# Altium project Placa_FdC.PrjPCB
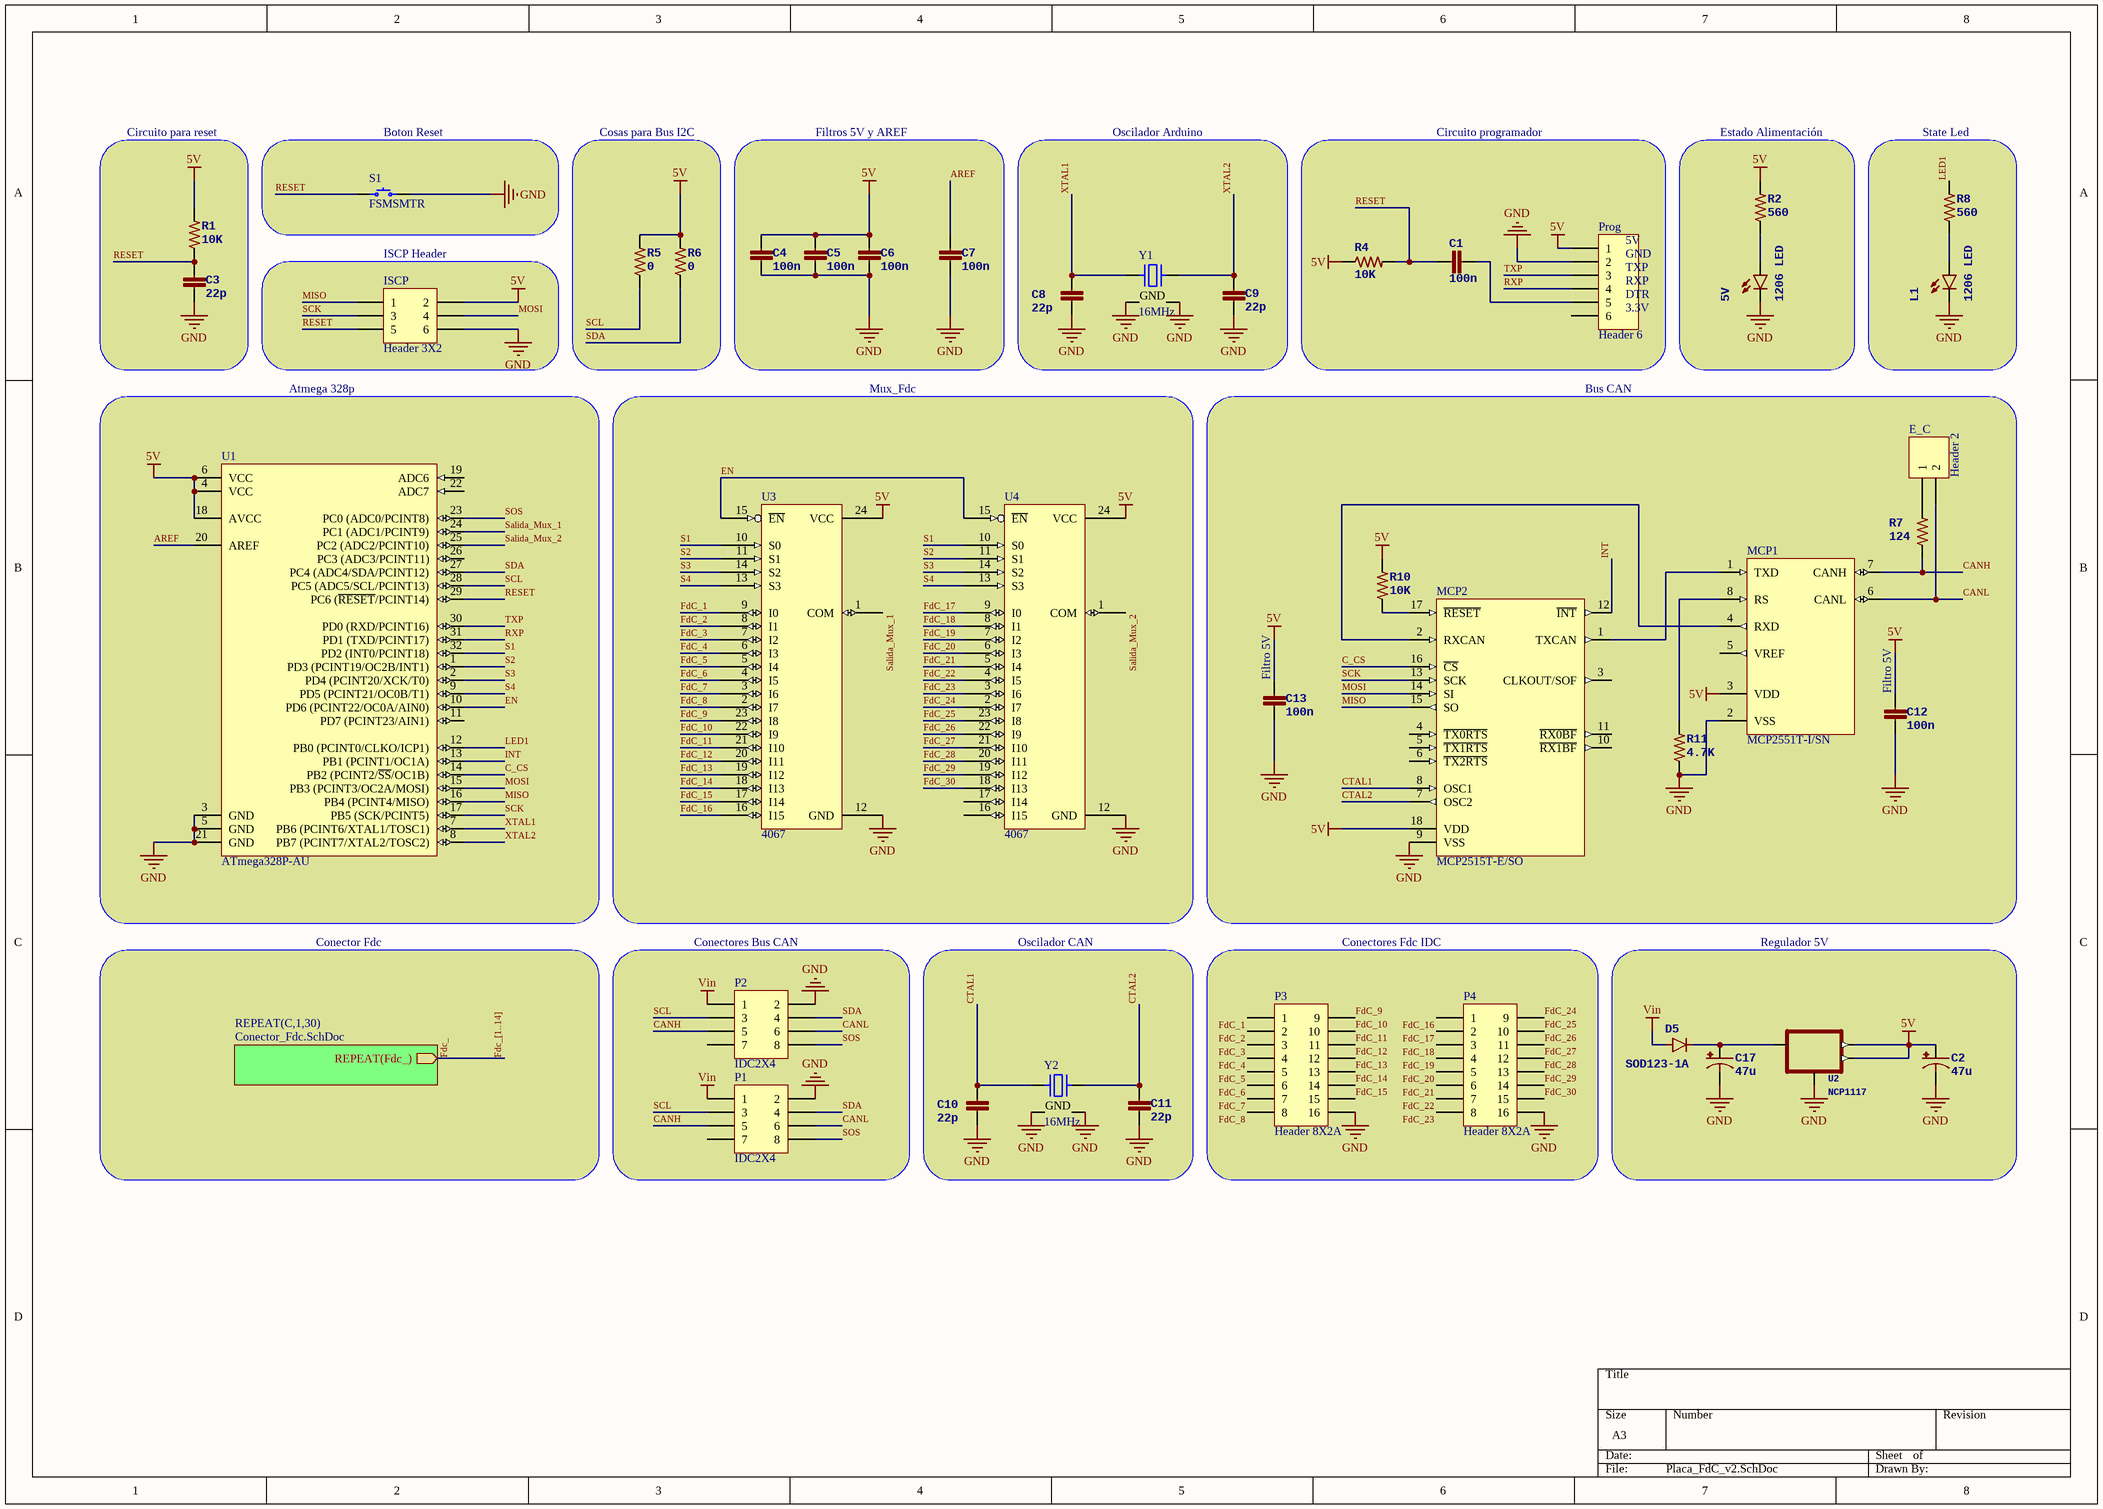
[diagram p0: Placa_FdC_v2.SchDoc]
2 sheets, 72 parts. Net scope: hierarchical (ports join the sheet entries above them; power ports are global).
Board file: Placa_FdC.PcbDoc
Sheets:
  Placa_FdC_v2.SchDoc
    C1 = Conector_Fdc.SchDoc
    C2 = Conector_Fdc.SchDoc
    C3 = Conector_Fdc.SchDoc
    C4 = Conector_Fdc.SchDoc
    C5 = Conector_Fdc.SchDoc
    C6 = Conector_Fdc.SchDoc
    C7 = Conector_Fdc.SchDoc
    C8 = Conector_Fdc.SchDoc
    C9 = Conector_Fdc.SchDoc
    C10 = Conector_Fdc.SchDoc
    C11 = Conector_Fdc.SchDoc
    C12 = Conector_Fdc.SchDoc
    C13 = Conector_Fdc.SchDoc
    C14 = Conector_Fdc.SchDoc
    C15 = Conector_Fdc.SchDoc
    C16 = Conector_Fdc.SchDoc
    C17 = Conector_Fdc.SchDoc
    C18 = Conector_Fdc.SchDoc
    C19 = Conector_Fdc.SchDoc
    C20 = Conector_Fdc.SchDoc
    C21 = Conector_Fdc.SchDoc
    C22 = Conector_Fdc.SchDoc
    C23 = Conector_Fdc.SchDoc
    C24 = Conector_Fdc.SchDoc
    C25 = Conector_Fdc.SchDoc
    C26 = Conector_Fdc.SchDoc
    C27 = Conector_Fdc.SchDoc
    C28 = Conector_Fdc.SchDoc
    C29 = Conector_Fdc.SchDoc
    C30 = Conector_Fdc.SchDoc

## Sheet Placa_FdC_v2.SchDoc
size A3

### Parts
5V  1206 LED  [LED-1206]
C1  100n  [0805]
C2  47u  [PANASONIC_D]
C3  22p  [0805]
C4  100n  [0805]
C5  100n  [0805]
C6  100n  [0805]
C7  100n  [0805]
C8  22p  [0805]
C9  22p  [0805]
C10  22p  [0805]
C11  22p  [0805]
C12  100n  [0805]
C13  100n  [0805]
C17  47u  [PANASONIC_D]
D5  SOD123-1A  [SOD-123]
E_C  Header 2  [HDR1X2]
ISCP  Header 3X2  [HDR2X3]
L1  1206 LED  [LED-1206]
MCP1  MCP2551T-I/SN  [SOIC-SN8_N]
MCP2  MCP2515T-E/SO  [SOIC-SO18_N]
P1  IDC2X4  [IDC2X4]
P2  IDC2X4  [IDC2X4]
P3  Header 8X2A  [HDR2X8_CEN]
P4  Header 8X2A  [HDR2X8_CEN]
Prog  Header 6  [HDR1X6]
R1  10K  [0805]
R2  560  [0805]
R4  10K  [0805]
R5  0  [0805]
R6  0  [0805]
R7  124  [0805]
R8  560  [0805]
R10  10K  [0805]
R11  4.7K  [0805]
S1  FSMSMTR  [TE FSMSMTR]
U1  ATmega328P-AU  [32A_N]
U2  NCP1117  [SOT223]
U3  4067  [SSOP-24]
U4  4067  [SSOP-24]
Y1  16MHz  [NDK NX3225SA]
Y2  16MHz  [NDK NX3225SA]

### Blocks framed on the sheet
Circuito para reset: C3 R1
Boton Reset: S1
Cosas para Bus I2C: R5 R6
Filtros 5V y AREF: C4-C7
Oscilador Arduino: C8 C9 Y1
Estado Alimentación: 5V R2
State Led: L1 R8
ISCP Header: ISCP
Atmega 328p: U1
Mux_Fdc: U3 U4
Conectores Bus CAN: P1 P2
Oscilador CAN: C10 C11 Y2
Conectores Fdc IDC: P3 P4
Regulador 5V: C2 C17 D5 U2

### Sub-sheets
REPEAT(C,1,30) = Conector_Fdc.SchDoc: REPEAT(Fdc_) (out)

### Nets
5V: C2.+ C4.1 C5.1 C6.1 C12.1 C13.1 ISCP.2 MCP1.3(VDD) MCP2.18(VDD) Prog.1 R1.2 R2.2 R4.1 R5.2 R6.2 R10.2 U1.4(VCC) U1.6(VCC) U1.18(AVCC) U2.2(OUT) U2.4(OUT@1) U3.24(VCC) U4.24(VCC)
GND: 5V.C C2.- C3.2 C4.2 C5.2 C6.2 C7.2 C8.2 C9.2 C10.2 C11.2 C12.2 C13.2 C17.- ISCP.6 L1.C MCP1.2(VSS) MCP2.9(VSS) P1.2 P2.2 P3.16 P4.16 Prog.2 R11.1 S1.2 U1.3(GND) U1.5(GND) U1.21(GND) U2.1(ADJ) U3.12(GND) U4.12(GND) Y1.2(GND) Y1.4(GND) Y2.2(GND) Y2.4(GND)
Vin: D5.A P1.1 P2.1
AREF: C7.1 U1.20(AREF)
C_CS: MCP2.16(~{CS}) U1.14(PB2_(PCINT2/~{SS}/OC1B))
CANH: MCP1.7(CANH) P1.5 P2.5 R7.1
CANL: E_C.2 MCP1.6(CANL) P1.6 P2.6
CTAL1: C10.1 MCP2.8(OSC1) Y2.1
CTAL2: C11.1 MCP2.7(OSC2) Y2.3
EN: U1.10(PD6_(PCINT22/OC0A/AIN0)) U3.15(~{EN}) U4.15(~{EN})
Fdc_: sheet REPEAT(C,1,30)/REPEAT(Fdc_)
FdC_1: P3.1 U3.9(I0)  [project net FdC]
FdC_2: P3.2 U3.8(I1)  [project net FdC]
FdC_3: P3.3 U3.7(I2)  [project net FdC]
FdC_4: P3.4 U3.6(I3)  [project net FdC]
FdC_5: P3.5 U3.5(I4)  [project net FdC]
FdC_6: P3.6 U3.4(I5)  [project net FdC]
FdC_7: P3.7 U3.3(I6)  [project net FdC]
FdC_8: P3.8 U3.2(I7)  [project net FdC]
FdC_9: P3.9 U3.23(I8)  [project net FdC]
FdC_10: P3.10 U3.22(I9)  [project net FdC]
FdC_11: P3.11 U3.21(I10)  [project net FdC]
FdC_12: P3.12 U3.20(I11)  [project net FdC]
FdC_13: P3.13 U3.19(I12)  [project net FdC]
FdC_14: P3.14 U3.18(I13)  [project net FdC]
FdC_15: P3.15 U3.17(I14)  [project net FdC]
FdC_16: P4.1 U3.16(I15)  [project net FdC]
FdC_17: P4.2 U4.9(I0)  [project net FdC]
FdC_18: P4.3 U4.8(I1)  [project net FdC]
FdC_19: P4.4 U4.7(I2)  [project net FdC]
FdC_20: P4.5 U4.6(I3)  [project net FdC]
FdC_21: P4.6 U4.5(I4)  [project net FdC]
FdC_22: P4.7 U4.4(I5)  [project net FdC]
FdC_23: P4.8 U4.3(I6)  [project net FdC]
FdC_24: P4.9 U4.2(I7)  [project net FdC]
FdC_25: P4.10 U4.23(I8)  [project net FdC]
FdC_26: P4.11 U4.22(I9)  [project net FdC]
FdC_27: P4.12 U4.21(I10)  [project net FdC]
FdC_28: P4.13 U4.20(I11)  [project net FdC]
FdC_29: P4.14 U4.19(I12)  [project net FdC]
FdC_30: P4.15 U4.18(I13)  [project net FdC]
INT: MCP2.12(~{INT}) U1.13(PB1_(PCINT1/OC1A))
LED1: R8.2 U1.12(PB0_(PCINT0/CLKO/ICP1))
MISO: ISCP.1 MCP2.15(SO) U1.16(PB4_(PCINT4/MISO))
MOSI: ISCP.4 MCP2.14(SI) U1.15(PB3_(PCINT3/OC2A/MOSI))
RESET: C1.1 C3.1 ISCP.5 R1.1 R4.2 S1.1 U1.29(PC6_(~{RESET}/PCINT14))
RXP: Prog.4 U1.31(PD1_(TXD/PCINT17))
S1: U1.32(PD2_(INT0/PCINT18)) U3.10(S0) U4.10(S0)
S2: U1.1(PD3_(PCINT19/OC2B/INT1)) U3.11(S1) U4.11(S1)
S3: U1.2(PD4_(PCINT20/XCK/T0)) U3.14(S2) U4.14(S2)
S4: U1.9(PD5_(PCINT21/OC0B/T1)) U3.13(S3) U4.13(S3)
Salida_Mux_1: U1.24(PC1_(ADC1/PCINT9)) U3.1(COM)
Salida_Mux_2: U1.25(PC2_(ADC2/PCINT10)) U4.1(COM)
SCK: ISCP.3 MCP2.13(SCK) U1.17(PB5_(SCK/PCINT5))
SCL: P1.3 P2.3 R5.1 U1.28(PC5_(ADC5/SCL/PCINT13))
SDA: P1.4 P2.4 R6.1 U1.27(PC4_(ADC4/SDA/PCINT12))
SOS: P1.8 P2.8 U1.23(PC0_(ADC0/PCINT8))
TXP: Prog.3 U1.30(PD0_(RXD/PCINT16))
XTAL1: C8.1 U1.7(PB6_(PCINT6/XTAL1/TOSC1)) Y1.1
XTAL2: C9.1 U1.8(PB7_(PCINT7/XTAL2/TOSC2)) Y1.3
Net5V_A: 5V.A R2.1
NetC1_2: C1.2 Prog.5
NetC17_+: C17.+ D5.C U2.3(IN)
NetE_C_1: E_C.1 R7.2
NetL1_A: L1.A R8.1
NetMCP1_1: MCP1.1(TXD) MCP2.1(TXCAN)
NetMCP1_4: MCP1.4(RXD) MCP2.2(RXCAN)
NetMCP1_8: MCP1.8(RS) R11.2
NetMCP2_17: MCP2.17(~{RESET}) R10.1

Not connected (* = marked no-connect by the designer): MCP1 5(VREF); MCP2 3(CLKOUT/SOF) 4(~{TX0RTS}) 5(~{TX1RTS}) 6(~{TX2RTS}) 10(~{RX1BF}) 11(~{RX0BF}); P1 7; P2 7; Prog 6; U1 11(PD7_(PCINT23/AIN1)) 19(ADC6) 22(ADC7) 26(PC3_(ADC3/PCINT11)); U4 16(I15) 17(I14)

### Buses and harness runs
bus Fdc_[1..14]

### Notes on the sheet
- Circuito programador
- (near Prog) 5V
- (near Prog) GND
- (near Prog) TXP
- (near Prog) RXP
- (near Prog) DTR
- (near Prog) 3.3V
- Bus CAN
- (near C13) Filtro 5V
- (near C12) Filtro 5V
- Conector Fdc

### Library data of the parts
5V L1 = LED1206
C1 C3-C13 = CAP0805
C2 C17 = 47UF-50V-20%(ELECT): PROD_ID: CAP-10547
D5 = DIODESOD123
E_C = Header 2: Header, 2-Pin; LatestRevisionDate: 17-Jul-2002; LatestRevisionNote: Re-released for DXP Platform.; Publisher: Altium Limited
ISCP = Header 3X2: Header, 3-Pin, Dual row; LatestRevisionDate: 17-Jul-2002; LatestRevisionNote: Re-released for DXP Platform.; Publisher: Altium Limited
MCP1 = MCP2551T-I/SN: High-Speed CAN Transceiver, 8-Pin SOIC, Industrial Temperature, Tape and Reel; Published: 29-Jan-2009; DatasheetVersion: revE, Jan-2007; PackageVersion: revBB, Aug-2009; PackageReference: SOIC-SN8; Publisher: Altium Limited; PackageDescription: 8-Lead Plastic Small Outline (SN) - Narrow, 3.90mm Body [SOIC]; Supplier 1: Digi-Key; Supplier Part Number 1: MCP2551T-I/SNTR-ND; Supplier 2: Farnell; Supplier Part Number 2: 1788569; Code_JEDEC: MS-012; Code_IPC: SOIC127P600-8; ComponentLink1Description: Datasheet; ComponentLink1URL: http://ww1.microchip.com/downloads/en/DeviceDoc/21667E.pdf; ComponentLink2Description: Packaging Specification; ComponentLink2URL: http://www.microchip.com/stellent/groups/techpub_sg/documents/packagingspec/en012702.pdf; ComponentLink3Description: Microchip.com Home; ComponentLink3URL: http://www.microchip.com/
MCP2 = MCP2515T-E/SO: Stand-Alone CAN Controller With SPI Interface, 18-Pin SOIC, Extended Temperature, Tape and Reel; Published: 29-Jan-2009; DatasheetVersion: revE, Nov-2007; PackageVersion: revBB, Aug-2009; PackageReference: SOIC-SO18; Publisher: Altium Limited; PackageDescription: 18-Lead Plastic Small Outline (SO) - Wide 7.50mm Body [SOIC]; Supplier 1: Digi-Key; Supplier Part Number 1: MCP2515T-E/SO-ND; Code_JEDEC: MS-013; ComponentLink1Description: Datasheet; ComponentLink1URL: http://ww1.microchip.com/downloads/en/DeviceDoc/21801e.pdf; ComponentLink2Description: Packaging Specification; ComponentLink2URL: http://www.microchip.com/stellent/groups/techpub_sg/documents/packagingspec/en012702.pdf; ComponentLink3Description: Microchip.com Home; ComponentLink3URL: http://www.microchip.com/
P1 P2 = IDC2X4: Header, 4-Pin, Dual row; LatestRevisionDate: 17-Jul-2002; LatestRevisionNote: Re-released for DXP Platform.; Publisher: Altium Limited
P3 P4 = Header 8X2A: Header, 8-Pin, Dual row; LatestRevisionDate: 17-Jul-2002; LatestRevisionNote: Re-released for DXP Platform.; Publisher: Altium Limited
Prog = Header 6: Header, 6-Pin; LatestRevisionDate: 17-Jul-2002; LatestRevisionNote: Re-released for DXP Platform.; Publisher: Altium Limited
R1 R2 R4-R8 R10 R11 = RESISTOR0805-RES
S1 = FSMSMTR: SWITCH TACTILE SPST-NO 0.05A 24V; Manufacturer: TE Connectivity Alcoswitch Switches; Switch Function: Off-Mom; Contact Rating @ Voltage: 0.05A @ 24VDC; Actuator Type: Standard; Actuator Orientation: Top Actuated; Illumination: Non-Illuminated; Operating Force: 180gf; Switch Travel: 0.25mm; Mechanical Life: 20,000 Cycles; Part Number: FSMSMTR; PartId: 8251; Supplier 1: Digi-Key; Supplier Part Number 1: 450-1758-2-ND; ComponentLink1Description: Datasheet; ComponentLink1URL: http://www.te.com/commerce/DocumentDelivery/DDEController?Action=srchrtrv&DocNm=1437566-3&DocType=Customer+Drawing&DocLang=English; ComponentLink2Description: Digi-Key Listing; ComponentLink2URL: http://www.digikey.com/product-detail/en/FSMSMTR/450-1758-2-ND/529671; Price: 0,175; Circuit: SPST-NO; Illumination Voltage: -; Illumination Type, Colour: -; Operating Temperature: -35C ~ 85C
U1 = ATmega328P-AU: 8-bit AVR Microcontroller, 32KB Flash, 1KB EEPROM, 2KB SRAM, 32-pin TQFP, Industrial Grade (-40°C to 85°C); Published: 1-Apr-2010; DatasheetVersion: revA, Jan-2010; PackageVersion: revB, Oct-2001; PackageReference: 32A; Publisher: Altium Limited; PackageDescription: 32-Lead, 7x7x1.0 mm Body, 0.8mm Lead Pitch, Thin Profile Plastic Quad Flat Package (TQFP); Supplier 1: Digi-Key; Supplier Part Number 1: ATMEGA328P-AU-ND; Supplier 2: Farnell; Supplier Part Number 2: 1715486; Supplier 3: Mouser; Supplier Part Number 3: 556-ATMEGA328P-AU; Code_JEDEC: MS-026-ABA; ComponentLink1Description: Manufacturer Link; ComponentLink1URL: http://www.atmel.com/products/avr/default.asp?; ComponentLink2Description: ATmega48A/48PA/88A/88PA/168A/168PA/328/328P Datasheet; ComponentLink2URL: http://www.atmel.com/dyn/resources/prod_documents/8271.pdf; ComponentLink3Description: ATmega48A/48PA/88A/88PA/168A/168PA/328/328P Summary; ComponentLink3URL: http://www.atmel.com/dyn/resources/prod_documents/8271S.pdf; ComponentLink4Description: Atmel.com Home; ComponentLink4URL: http://www.atmel.com
U2 = V_REG_LM1117SOT223: PROD_ID: VREG-08170
U3 U4 = MUX-74HC4067
Y1 Y2 = NX3225SA-16.000MHZ-STD-CSR-1: CRYSTAL 16.0000MHZ 8PF SMD; Manufacturer: NDK; Frequency Stability: 15ppm; ESR: 80 Ohm; Operating Mode: Fundamental; Part Number: NX3225SA-16.000MHZ-STD-CSR-1; PartId: 8509; Supplier 1: Digi-Key; Supplier Part Number 1: 644-1049-2-ND; ComponentLink1Description: Datasheet; ComponentLink1URL: http://media.digikey.com/pdf/Data%20Sheets/NDK%20PDFs/NX3225SA.pdf; ComponentLink2Description: Digi-Key Listing; ComponentLink2URL: http://www.digikey.com/product-detail/en/NX3225SA-16.000MHZ-STD-CSR-1/644-1049-2-ND/1128831; Price: 0,3799; Type: MHz Crystal; Device Package: 4-SMD, No Lead (DFN, LCC); Frequency: 16MHz; Frequency Tolerance: 15ppm; Load Capacitance: 8pF

## Sheet Conector_Fdc.SchDoc
size A4
Used 30 times, as channels C1, C2, C3, C4, C5, C6, C7, C8, C9, C10, C11, C12, C13, C14, C15, C16, C17, C18, C19, C20, C21, C22, C23, C24, C25, C26, C27, C28, C29, C30. Parts and nets are listed once, with the designators drawn on the sheet.
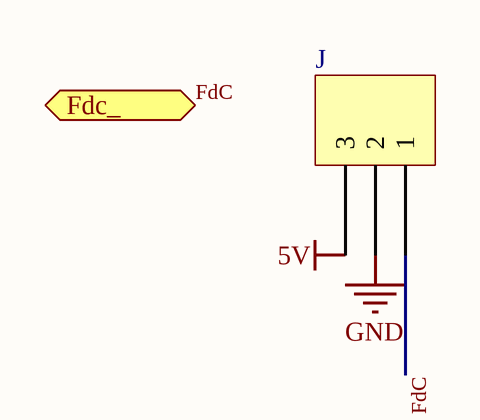
[diagram p1: Conector_Fdc.SchDoc]

### Parts
J  282834-3  [TE 282834-3]  (value not drawn)

### Ports
Fdc_ (out)

### Nets
5V: J.3
GND: J.2
FdC: J.1 ; port Fdc_

### Channels
C1: designators end in _C1; ports Fdc_=FdC
C2: designators end in _C2; ports Fdc_=FdC
C3: designators end in _C3; ports Fdc_=FdC
C4: designators end in _C4; ports Fdc_=FdC
C5: designators end in _C5; ports Fdc_=FdC
C6: designators end in _C6; ports Fdc_=FdC
C7: designators end in _C7; ports Fdc_=FdC
C8: designators end in _C8; ports Fdc_=FdC
C9: designators end in _C9; ports Fdc_=FdC
C10: designators end in _C10; ports Fdc_=FdC
C11: designators end in _C11; ports Fdc_=FdC
C12: designators end in _C12; ports Fdc_=FdC
C13: designators end in _C13; ports Fdc_=FdC
C14: designators end in _C14; ports Fdc_=FdC
C15: designators end in _C15; ports Fdc_=FdC
C16: designators end in _C16; ports Fdc_=FdC
C17: designators end in _C17; ports Fdc_=FdC
C18: designators end in _C18; ports Fdc_=FdC
C19: designators end in _C19; ports Fdc_=FdC
C20: designators end in _C20; ports Fdc_=FdC
C21: designators end in _C21; ports Fdc_=FdC
C22: designators end in _C22; ports Fdc_=FdC
C23: designators end in _C23; ports Fdc_=FdC
C24: designators end in _C24; ports Fdc_=FdC
C25: designators end in _C25; ports Fdc_=FdC
C26: designators end in _C26; ports Fdc_=FdC
C27: designators end in _C27; ports Fdc_=FdC
C28: designators end in _C28; ports Fdc_=FdC
C29: designators end in _C29; ports Fdc_=FdC
C30: designators end in _C30; ports Fdc_=FdC

### Library data of the parts
J = 282834-3: TERM BLOCK 3POS SIDE ENT 2.54MM; Manufacturer: TE Connectivity AMP Connectors; TemperatureRange: -40C ~ 105C; Voltage: 150V; Pitch: 0.100" (2.54mm); Number Of Levels: 1; Positions Per Level: 3; Part Number: 282834-3; PartId: 9290; Supplier 1: Digi-Key; Supplier Part Number 1: A98334-ND; ComponentLink1Description: Datasheet; ComponentLink1URL: http://www.te.com/commerce/DocumentDelivery/DDEController?Action=srchrtrv&DocNm=282834&DocType=Customer+Drawing&DocLang=English; ComponentLink2Description: Digi-Key Listing; ComponentLink2URL: http://www.digikey.ca/product-detail/en/282834-3/A98334-ND/1153264; Price: 2,25; Colour: Green; Orientation: Horizontal with Board

## Nets that join several sheets
5V: Placa_FdC_v2 (23 pins), C1 (J_C1.3), C2 (J_C2.3), C3 (J_C3.3), C4 (J_C4.3), C5 (J_C5.3), C6 (J_C6.3), C7 (J_C7.3), C8 (J_C8.3), C9 (J_C9.3), C10 (J_C10.3), C11 (J_C11.3), C12 (J_C12.3), C13 (J_C13.3), C14 (J_C14.3), C15 (J_C15.3), C16 (J_C16.3), C17 (J_C17.3), C18 (J_C18.3), C19 (J_C19.3), C20 (J_C20.3), C21 (J_C21.3), C22 (J_C22.3), C23 (J_C23.3), C24 (J_C24.3), C25 (J_C25.3), C26 (J_C26.3), C27 (J_C27.3), C28 (J_C28.3), C29 (J_C29.3), C30 (J_C30.3)
GND: Placa_FdC_v2 (35 pins), C1 (J_C1.2), C2 (J_C2.2), C3 (J_C3.2), C4 (J_C4.2), C5 (J_C5.2), C6 (J_C6.2), C7 (J_C7.2), C8 (J_C8.2), C9 (J_C9.2), C10 (J_C10.2), C11 (J_C11.2), C12 (J_C12.2), C13 (J_C13.2), C14 (J_C14.2), C15 (J_C15.2), C16 (J_C16.2), C17 (J_C17.2), C18 (J_C18.2), C19 (J_C19.2), C20 (J_C20.2), C21 (J_C21.2), C22 (J_C22.2), C23 (J_C23.2), C24 (J_C24.2), C25 (J_C25.2), C26 (J_C26.2), C27 (J_C27.2), C28 (J_C28.2), C29 (J_C29.2), C30 (J_C30.2)
FdC: Placa_FdC_v2 (P3.8 U3.2), C8 (J_C8.1)
FdC: Placa_FdC_v2 (P3.7 U3.3), C7 (J_C7.1)
FdC: Placa_FdC_v2 (P3.6 U3.4), C6 (J_C6.1)
FdC: Placa_FdC_v2 (P3.5 U3.5), C5 (J_C5.1)
FdC: Placa_FdC_v2 (P3.4 U3.6), C4 (J_C4.1)
FdC: Placa_FdC_v2 (P3.3 U3.7), C3 (J_C3.1)
FdC: Placa_FdC_v2 (P3.2 U3.8), C2 (J_C2.1)
FdC: Placa_FdC_v2 (P3.1 U3.9), C1 (J_C1.1)
FdC: Placa_FdC_v2 (P4.1 U3.16), C16 (J_C16.1)
FdC: Placa_FdC_v2 (P3.15 U3.17), C15 (J_C15.1)
FdC: Placa_FdC_v2 (P3.14 U3.18), C14 (J_C14.1)
FdC: Placa_FdC_v2 (P3.13 U3.19), C13 (J_C13.1)
FdC: Placa_FdC_v2 (P3.12 U3.20), C12 (J_C12.1)
FdC: Placa_FdC_v2 (P3.11 U3.21), C11 (J_C11.1)
FdC: Placa_FdC_v2 (P3.10 U3.22), C10 (J_C10.1)
FdC: Placa_FdC_v2 (P3.9 U3.23), C9 (J_C9.1)
FdC: Placa_FdC_v2 (P4.9 U4.2), C24 (J_C24.1)
FdC: Placa_FdC_v2 (P4.8 U4.3), C23 (J_C23.1)
FdC: Placa_FdC_v2 (P4.7 U4.4), C22 (J_C22.1)
FdC: Placa_FdC_v2 (P4.6 U4.5), C21 (J_C21.1)
FdC: Placa_FdC_v2 (P4.5 U4.6), C20 (J_C20.1)
FdC: Placa_FdC_v2 (P4.4 U4.7), C19 (J_C19.1)
FdC: Placa_FdC_v2 (P4.3 U4.8), C18 (J_C18.1)
FdC: Placa_FdC_v2 (P4.2 U4.9), C17 (J_C17.1)
FdC: Placa_FdC_v2 (P4.15 U4.18), C30 (J_C30.1)
FdC: Placa_FdC_v2 (P4.14 U4.19), C29 (J_C29.1)
FdC: Placa_FdC_v2 (P4.13 U4.20), C28 (J_C28.1)
FdC: Placa_FdC_v2 (P4.12 U4.21), C27 (J_C27.1)
FdC: Placa_FdC_v2 (P4.11 U4.22), C26 (J_C26.1)
FdC: Placa_FdC_v2 (P4.10 U4.23), C25 (J_C25.1)